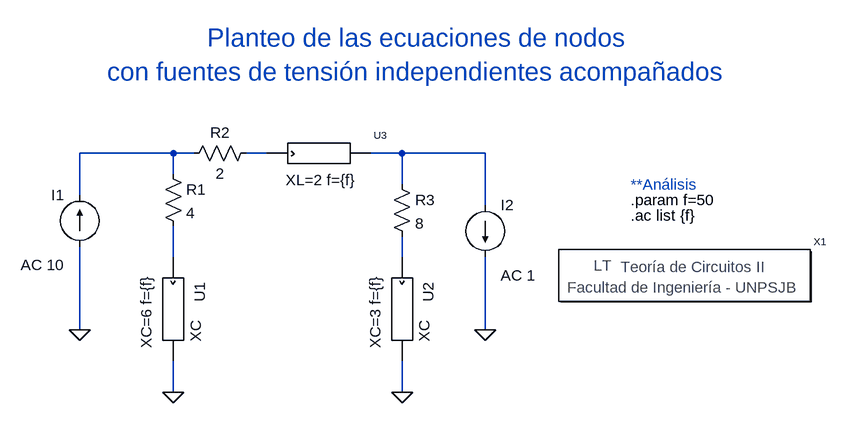
[diagram p0: schematic tarea.asc]
tarea.asc, the LTspice schematic file:
Version 4
SHEET 1 1308 680
WIRE 176 64 32 64
WIRE 208 64 176 64
WIRE 320 64 288 64
WIRE 528 64 480 64
WIRE 656 64 528 64
WIRE 176 96 176 64
WIRE 528 112 528 64
WIRE 32 128 32 64
WIRE 656 144 656 64
WIRE 176 224 176 176
WIRE 528 224 528 192
WIRE 32 336 32 208
WIRE 656 336 656 224
WIRE 176 432 176 384
WIRE 528 432 528 384
FLAG 32 336 0
FLAG 176 432 0
FLAG 656 336 0
FLAG 528 432 0
SYMBOL current 32 208 R180
WINDOW 0 24 80 Left 2
WINDOW 3 24 0 Left 2
WINDOW 123 24 -28 Left 2
WINDOW 39 0 0 Left 0
SYMATTR InstName I1
SYMATTR Value ""
SYMATTR Value2 AC 10
SYMBOL res 160 80 R0
SYMATTR InstName R1
SYMATTR Value 4
SYMBOL res 304 48 R90
WINDOW 0 0 56 VBottom 2
WINDOW 3 32 56 VTop 2
SYMATTR InstName R2
SYMATTR Value 2
SYMBOL res 512 96 R0
SYMATTR InstName R3
SYMATTR Value 8
SYMBOL current 656 144 R0
WINDOW 123 24 108 Left 2
WINDOW 39 0 0 Left 0
SYMATTR InstName I2
SYMATTR Value ""
SYMATTR Value2 AC 1
SYMBOL Circuitos2\\ComponentesCA\\XC 176 304 R90
SYMATTR InstName U1
SYMATTR SpiceLine XC=6 f={f}
SYMBOL Circuitos2\\ComponentesCA\\XC 528 304 R90
SYMATTR InstName U2
SYMATTR SpiceLine XC=3 f={f}
SYMBOL Circuitos2\\ComponentesCA\\XL 400 64 R0
SYMATTR SpiceLine XL=2 f={f}
SYMATTR InstName U3
SYMBOL Circuitos2\\Letreros\\Teoría\ de\ Circuitos\ II 960 256 R0
SYMATTR InstName X1
TEXT 880 160 Left 2 !.ac list {f}
TEXT 880 136 Left 2 !.param f=50
TEXT 552 -88 Center 4 ;Planteo de las ecuaciones de nodos\ncon fuentes de tensión independientes acompañados
TEXT 880 112 Left 2 ;**Análisis

The netlist it stands for:
* tarea.asc
I1 0 N001 AC 10
R1 N001 N004 4
R2 N002 N001 2
R3 N003 N005 8
I2 N003 0 AC 1
XU1 N004 0 XC XC=6 f={f}  ; pins 1 2
XU2 N005 0 XC XC=3 f={f}  ; pins 1 2
XU3 N002 N003 XL XL=2 f={f}  ; pins 1 2
XX1 Teoría de Circuitos II
.ac list {f}
.param f=50
* Planteo de las ecuaciones de nodos
* con fuentes de tensión independientes acompañados
* **Análisis
.lib ..\sym\Circuitos2\ComponentesCA\impedancias.lib
.backanno
.end